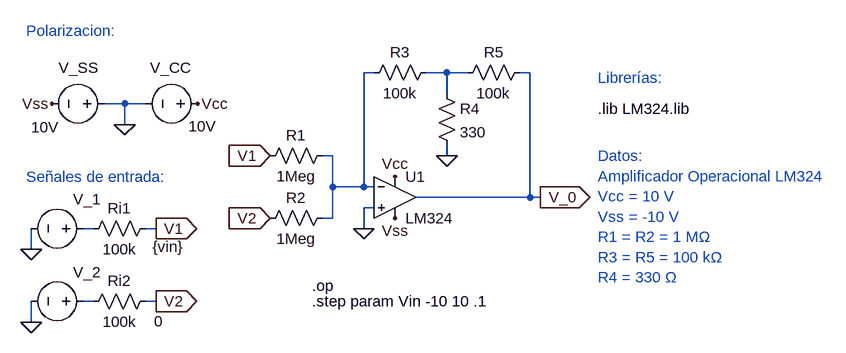
[diagram p0: schematic Lab_2_Circ_1_Ri=100k+Vo=f(V1).asc]
Lab_2_Circ_1_Ri=100k+Vo=f(V1).asc, the LTspice schematic file:
Version 4
SHEET 1 1708 680
WIRE 720 -304 704 -304
WIRE 832 -304 800 -304
WIRE 864 -304 832 -304
WIRE 960 -304 944 -304
WIRE 832 -272 832 -304
WIRE 336 -256 304 -256
WIRE 368 -256 336 -256
WIRE 336 -224 336 -256
WIRE 656 -176 640 -176
WIRE 832 -176 832 -192
WIRE 656 -128 656 -176
WIRE 704 -128 704 -304
WIRE 704 -128 656 -128
WIRE 720 -128 704 -128
WIRE 960 -112 960 -304
WIRE 960 -112 784 -112
WIRE 976 -112 960 -112
WIRE 720 -96 704 -96
WIRE 656 -80 656 -128
WIRE 656 -80 640 -80
WIRE 288 -64 272 -64
WIRE 384 -64 368 -64
WIRE 704 -64 704 -96
WIRE 192 -32 192 -64
WIRE 288 48 272 48
WIRE 384 48 368 48
WIRE 192 80 192 48
FLAG 704 -64 0
FLAG 448 -256 Vcc
FLAG 752 -144 Vcc
FLAG 224 -256 Vss
FLAG 752 -80 Vss
FLAG 336 -224 0
FLAG 560 -176 V1
IOPIN 560 -176 In
FLAG 560 -80 V2
IOPIN 560 -80 In
FLAG 976 -112 V_0
IOPIN 976 -112 Out
FLAG 832 -176 0
FLAG 192 -32 0
FLAG 384 -64 V1
IOPIN 384 -64 Out
FLAG 192 80 0
FLAG 384 48 V2
IOPIN 384 48 Out
SYMBOL OpAmps\\opamp2 752 -176 R0
SYMATTR InstName U1
SYMATTR Value LM324
SYMBOL res 816 -288 R0
SYMATTR InstName R4
SYMATTR Value 330
SYMBOL res 656 -192 R90
WINDOW 0 0 56 VBottom 2
WINDOW 3 32 56 VTop 2
SYMATTR InstName R1
SYMATTR Value 1Meg
SYMBOL voltage 464 -256 R90
WINDOW 0 -55 25 VRight 2
WINDOW 3 35 -13 VRight 2
WINDOW 123 0 0 Left 0
WINDOW 39 0 0 Left 0
SYMATTR InstName V_CC
SYMATTR Value 10V
SYMBOL voltage 320 -256 R90
WINDOW 0 -55 25 VRight 2
WINDOW 3 36 85 VRight 2
WINDOW 123 0 0 Left 0
WINDOW 39 0 0 Left 0
SYMATTR InstName V_SS
SYMATTR Value 10V
SYMBOL res 704 -288 R270
WINDOW 0 32 56 VTop 2
WINDOW 3 0 56 VBottom 2
SYMATTR InstName R3
SYMATTR Value 100k
SYMBOL res 848 -288 R270
WINDOW 0 32 56 VTop 2
WINDOW 3 0 56 VBottom 2
SYMATTR InstName R5
SYMATTR Value 100k
SYMBOL res 656 -96 R90
WINDOW 0 0 56 VBottom 2
WINDOW 3 32 56 VTop 2
SYMATTR InstName R2
SYMATTR Value 1Meg
SYMBOL res 272 -48 R270
WINDOW 0 32 56 VTop 2
WINDOW 3 0 56 VBottom 2
SYMATTR InstName Ri1
SYMATTR Value 100k
SYMBOL res 272 64 R270
WINDOW 0 32 56 VTop 2
WINDOW 3 0 56 VBottom 2
SYMATTR InstName Ri2
SYMATTR Value 100k
SYMBOL voltage 288 -64 M270
WINDOW 0 45 31 VLeft 2
WINDOW 3 -28 -91 VLeft 2
WINDOW 123 -1 -51 VLeft 2
WINDOW 39 0 0 Left 0
SYMATTR InstName V_1
SYMATTR Value {vin}
SYMBOL voltage 288 48 M270
WINDOW 0 45 31 VLeft 2
WINDOW 3 -31 -93 VLeft 2
WINDOW 123 0 0 Left 0
WINDOW 39 0 0 Left 0
SYMATTR InstName V_2
SYMATTR Value 0
TEXT 1064 -248 Left 2 !.lib LM324.lib
TEXT 1064 -296 Left 2 ;Librerías:
TEXT 184 -368 Left 2 ;Polarizacion:
TEXT 184 -144 Left 2 ;Señales de entrada:
TEXT 1064 -176 Left 2 ;Datos:\nAmplificador Operacional LM324\nVcc = 10 V\nVss = -10 V\nR1 = R2 = 1 MΩ\nR3 = R5 = 100 kΩ\nR4 = 330 Ω
TEXT 624 24 Left 2 !.op
TEXT 624 48 Left 2 !.step param Vin -10 10 .1

The netlist it stands for:
* Lab_2_Circ_1_Ri=100k+Vo=f(V1).asc
XU1 0 N001 Vcc Vss V_0 LM324  ; pins In+ In- V+ V- OUT
R4 N002 0 330
R1 N001 V1 1Meg
V_CC Vcc 0 10V
V_SS 0 Vss 10V
R3 N001 N002 100k
R5 N002 V_0 100k
R2 N001 V2 1Meg
Ri1 N003 V1 100k
Ri2 N004 V2 100k
V_1 N003 0 {vin}
V_2 N004 0 0
.lib LM324.lib
* Librerías:
* Polarizacion:
* Señales de entrada:
* Datos:
* Amplificador Operacional LM324
* Vcc = 10 V
* Vss = -10 V
* R1 = R2 = 1 MΩ
* R3 = R5 = 100 kΩ
* R4 = 330 Ω
.op
.step param Vin -10 10 .1
.backanno
.end